# Altium schematic sheet StEth32_Base_µC.SchDoc
size A4
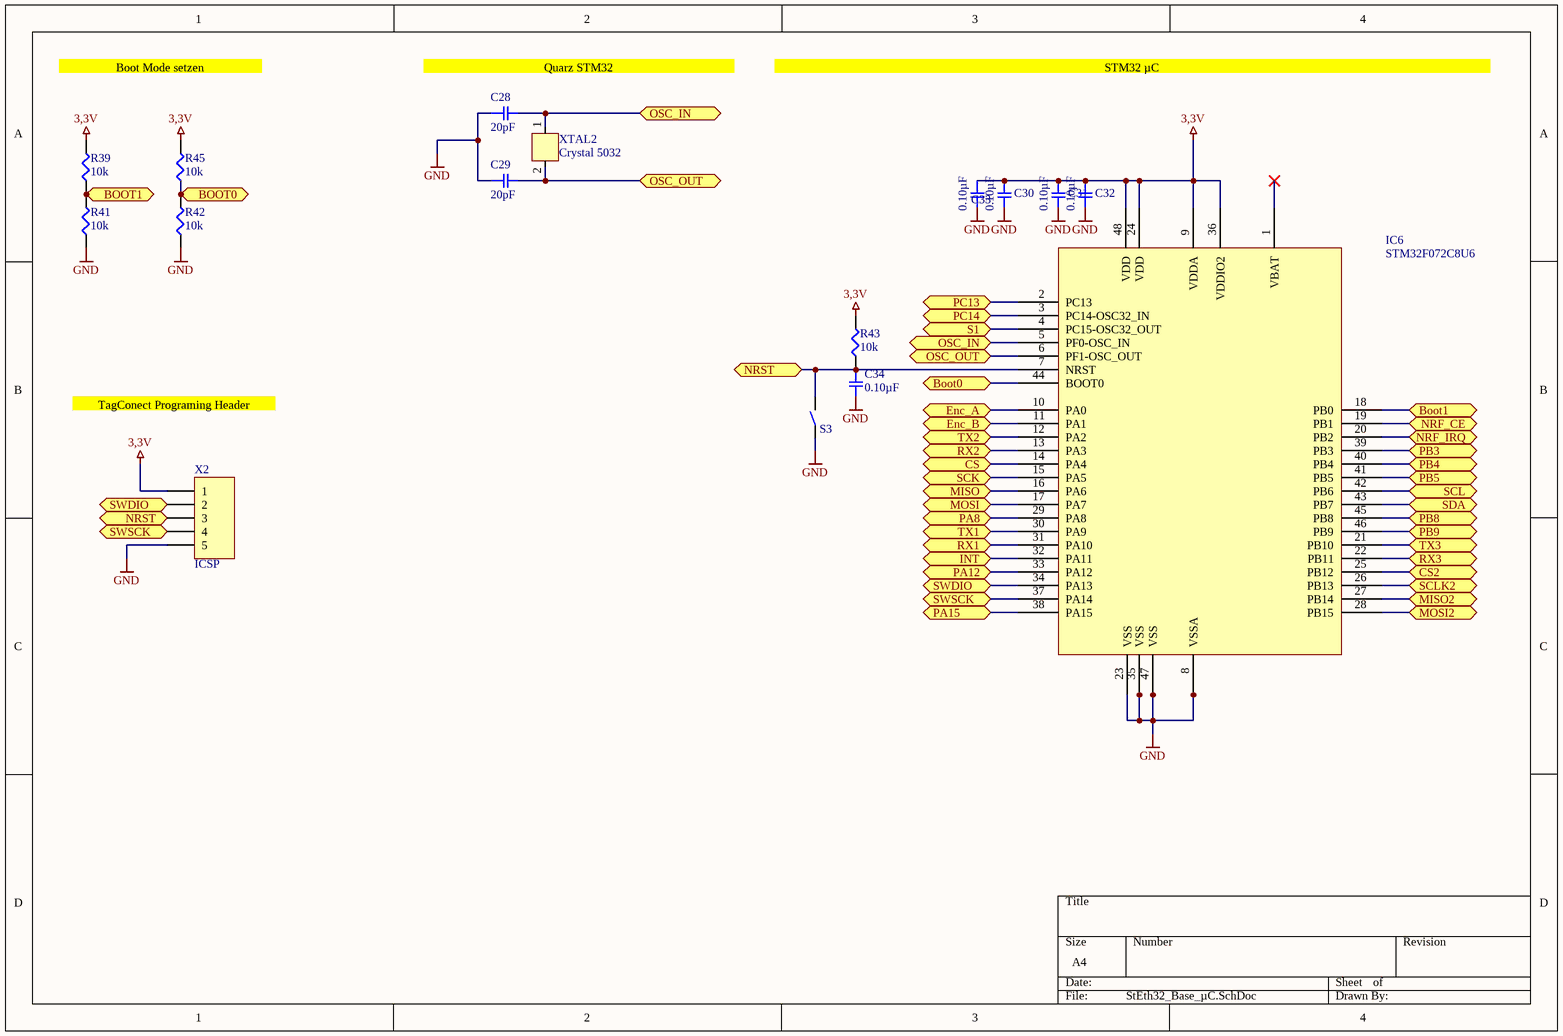
[diagram p0: StEth32_Base_µC.SchDoc]

## Parts
C28  20pF  [SMD-0603C]
C29  20pF  [SMD-0603C]
C30  0.10µF  [SMD-0603C]
C31  0.10µF  [SMD-0603C]
C32  0.10µF  [SMD-0603C]
C33  0.10µF  [SMD-0603C]
C34  0.10µF  [SMD-0603C]
IC6  STM32F072C8U6  [LQFP-48]
R39  10k  [SMD-0603-RES]
R41  10k  [SMD-0603-RES]
R42  10k  [SMD-0603-RES]
R43  10k  [SMD-0603-RES]
R45  10k  [SMD-0603-RES]
S3  Button  [Button5050]  (value not drawn)
X2  ICSP  [TC2030-MCP-NL]
XTAL2  Crystal 5032  [5032]

## Ports
Boot0 (bidir), BOOT0 (bidir), BOOT1 (bidir), Boot1 (bidir), CS2 (bidir), CS (bidir), Enc_A (bidir), Enc_B (bidir), INT (bidir), MISO2 (bidir), MISO (bidir), MOSI2 (bidir), MOSI (bidir), NRF_CE (bidir), NRF_IRQ (bidir), NRST (bidir), OSC_IN (bidir), OSC_OUT (bidir), PA8 (bidir), PA12 (bidir), PA15 (bidir), PB3 (bidir), PB4 (bidir), PB5 (bidir), PB8 (bidir), PB9 (bidir), PC13 (bidir), PC14 (bidir), RX1 (bidir), RX2 (bidir), RX3 (bidir), S1 (bidir), SCK (bidir), SCL (bidir), SCLK2 (bidir), SDA (bidir), SWDIO (bidir), SWSCK (bidir), TX1 (bidir), TX2 (bidir), TX3 (bidir)

## Nets
3,3V: C30.1 C31.1 C32.1 C33.1 IC6.9(VDDA) IC6.24(VDD) IC6.36(VDDIO2) IC6.48(VDD) R39.2 R43.2 R45.2 X2.1
GND: C28.1 C29.1 C30.2 C31.2 C32.2 C33.2 C34.2 IC6.8(VSSA) IC6.23(VSS) IC6.35(VSS) IC6.47(VSS) R41.1 R42.1 S3.1 X2.5
Boot0: IC6.44(BOOT0) R42.2 R45.1 ; port Boot0, port BOOT0
BOOT1: IC6.18(PB0) R39.1 R41.2 ; port BOOT1, port Boot1
CS: IC6.14(PA4) ; port CS
CS2: IC6.25(PB12) ; port CS2
Enc_A: IC6.10(PA0) ; port Enc_A
Enc_B: IC6.11(PA1) ; port Enc_B
INT: IC6.32(PA11) ; port INT
MISO: IC6.16(PA6) ; port MISO
MISO2: IC6.27(PB14) ; port MISO2
MOSI: IC6.17(PA7) ; port MOSI
MOSI2: IC6.28(PB15) ; port MOSI2
NRF_CE: IC6.19(PB1) ; port NRF_CE
NRF_IRQ: IC6.20(PB2) ; port NRF_IRQ
NRST: C34.1 IC6.7(NRST) R43.1 S3.2 X2.3 ; port NRST
OSC_IN: C28.2 IC6.5(PF0-OSC_IN) XTAL2.1 ; port OSC_IN
OSC_OUT: C29.2 IC6.6(PF1-OSC_OUT) XTAL2.2 ; port OSC_OUT
PA8: IC6.29(PA8) ; port PA8
PA12: IC6.33(PA12) ; port PA12
PA15: IC6.38(PA15) ; port PA15
PB3: IC6.39(PB3) ; port PB3
PB4: IC6.40(PB4) ; port PB4
PB5: IC6.41(PB5) ; port PB5
PB8: IC6.45(PB8) ; port PB8
PB9: IC6.46(PB9) ; port PB9
PC13: IC6.2(PC13) ; port PC13
PC14: IC6.3(PC14-OSC32_IN) ; port PC14
RX1: IC6.31(PA10) ; port RX1
RX2: IC6.13(PA3) ; port RX2
RX3: IC6.22(PB11) ; port RX3
S1: IC6.4(PC15-OSC32_OUT) ; port S1
SCK: IC6.15(PA5) ; port SCK
SCL: IC6.42(PB6) ; port SCL
SCLK2: IC6.26(PB13) ; port SCLK2
SDA: IC6.43(PB7) ; port SDA
SWDIO: IC6.34(PA13) X2.2 ; port SWDIO
SWSCK: IC6.37(PA14) X2.4 ; port SWSCK
TX1: IC6.30(PA9) ; port TX1
TX2: IC6.12(PA2) ; port TX2
TX3: IC6.21(PB10) ; port TX3

Not connected (* = marked no-connect by the designer): IC6 1(VBAT)*

## Notes on the sheet
- Boot Mode setzen
- Quarz STM32
- STM32 µC
  STM32 µC
- TagConect Programing Header

## Library data of the parts
C28-C34 = GCM188R71C104KA37J: CAP CER 0.1UF 16V X7R 0603; Manufacturer: Murata Electronics North America; Factory Stock: 0; Unit Price (USD): 0.18; Minimum Quantity: 1; Tolerance: ±10%; Datasheets: http://www.murata.com/~/media/webrenewal/support/library/catalog/products/capacitor/mlcc/c03e.ashx; Image: //media.digikey.com/Renders/Murata%20Renders/0603%28GCM188%29.jpg; Digi-Key Part Number: 490-8015-1-ND; Part Number: GCM188R71C104KA37J; Quantity Available: 17844; @ qty: 0; Packaging: Cut Tape (CT); Series: GCM; Part Status: Active; Voltage: 16V; Temperature Coefficient: X7R; Operating Temperature: -55°C ~ 125°C; Features: -; Ratings: AEC-Q200; Applications: Automotive; Mounting Type: Surface Mount, MLCC; Package / Case: 0603 (1608 Metric); Size / Dimension: 0.063" L x 0.031" W (1.60mm x 0.80mm); Height - Seated (Max): -; Thickness (Max): 0.035" (0.90mm); Lead Spacing: -; Lead Style: -
  C28 C29: Value: 20pF
  C30-C34: Value: 0.10µF
R39 R41-R43 R45 = ERJ-3EKF1002V: RES SMD 10K OHM 1% 1/10W 0603; Manufacturer: Panasonic Electronic Components; Factory Stock: 0; Unit Price (USD): 0.00379; @ qty: 1500; Minimum Quantity: 1; Power (Watts): 0.1W, 1/10W; Temperature Coefficient: ±100ppm/°C; Part Number: ERJ-3EKF1002V; Datasheets: http://industrial.panasonic.com/www-cgi/jvcr13pz.cgi?E+PZ+3+AOA0002+ERJ3EKF1002V+7+WW; Image: //media.digikey.com/Photos/Panasonic%20Photos/MFG_ERJ-P6W%20Series.jpg; Digi-Key Part Number: P10.0KHCT-ND; Quantity Available: 6703141; Packaging: Cut Tape (CT); Series: ERJ; Part Status: Active; Value: 10k; Tolerance: ±1%; Composition: Thick Film; Features: Automotive AEC-Q200; Operating Temperature: -55°C ~ 155°C; Package / Case: 0603 (1608 Metric); Supplier Device Package: 0603; Size / Dimension: 0.063" L x 0.031" W (1.60mm x 0.80mm); Height - Seated (Max): 0.022" (0.55mm); Number of Terminations: 2; Failure Rate: -
S3 = Button: 6.1x3.7x2.5mm
XTAL2 = 5032